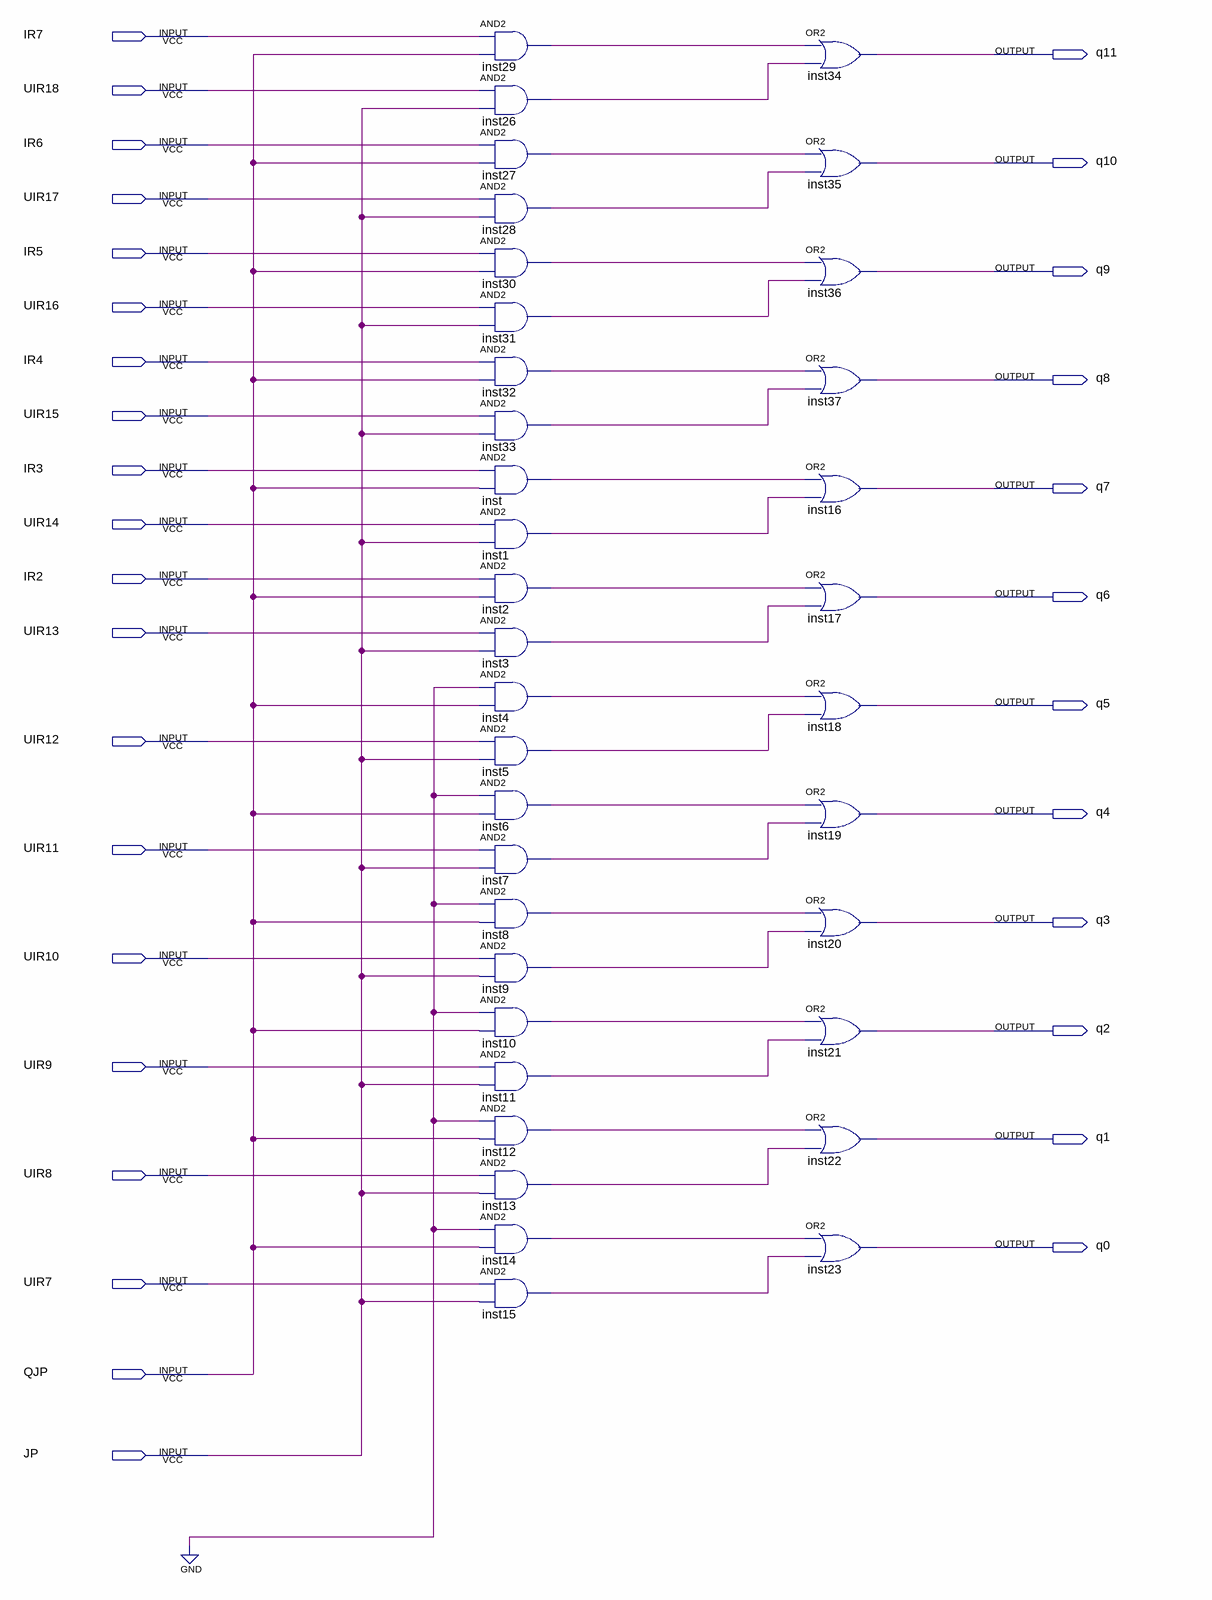
[diagram p0: schematic sheet]
// Quartus schematic hjcg.bdf as structural Verilog: 36 symbols, 32 pins
module hjcg (
  input  IR7,
  input  UIR18,
  input  IR6,
  input  UIR17,
  input  IR5,
  input  UIR16,
  input  IR4,
  input  UIR15,
  input  IR3,
  input  UIR14,
  input  IR2,
  input  UIR13,
  input  UIR12,
  input  UIR11,
  input  UIR10,
  input  UIR9,
  input  UIR8,
  input  UIR7,
  input  QJP,
  input  JP,
  output q11,
  output q10,
  output q9,
  output q8,
  output q7,
  output q6,
  output q5,
  output q4,
  output q3,
  output q2,
  output q1,
  output q0
);

  wire inst1_out, inst2_out, inst3_out, inst4_out, inst5_out, inst6_out, inst7_out, inst8_out, inst9_out,
       inst10_out, inst11_out, inst12_out, inst13_out, inst14_out, inst15_out, inst26_out, inst27_out,
       inst28_out, inst29_out, inst30_out, inst31_out, inst32_out, inst33_out, inst_out;

  and inst29 (inst29_out, IR7, QJP);
  and inst26 (inst26_out, UIR18, JP);
  and inst27 (inst27_out, IR6, QJP);
  and inst28 (inst28_out, UIR17, JP);
  and inst30 (inst30_out, IR5, QJP);
  and inst31 (inst31_out, UIR16, JP);
  and inst32 (inst32_out, IR4, QJP);
  and inst33 (inst33_out, UIR15, JP);
  and inst (inst_out, IR3, QJP);
  and inst1 (inst1_out, UIR14, JP);
  and inst2 (inst2_out, IR2, QJP);
  and inst3 (inst3_out, UIR13, JP);
  and inst4 (inst4_out, 1'b0, QJP);
  and inst5 (inst5_out, UIR12, JP);
  and inst6 (inst6_out, 1'b0, QJP);
  and inst7 (inst7_out, UIR11, JP);
  and inst8 (inst8_out, 1'b0, QJP);
  and inst9 (inst9_out, UIR10, JP);
  and inst10 (inst10_out, 1'b0, QJP);
  and inst11 (inst11_out, UIR9, JP);
  and inst12 (inst12_out, 1'b0, QJP);
  and inst13 (inst13_out, UIR8, JP);
  and inst14 (inst14_out, 1'b0, QJP);
  and inst15 (inst15_out, UIR7, JP);
  or inst34 (q11, inst29_out, inst26_out);
  or inst35 (q10, inst27_out, inst28_out);
  or inst36 (q9, inst30_out, inst31_out);
  or inst37 (q8, inst32_out, inst33_out);
  or inst16 (q7, inst_out, inst1_out);
  or inst17 (q6, inst2_out, inst3_out);
  or inst18 (q5, inst4_out, inst5_out);
  or inst19 (q4, inst6_out, inst7_out);
  or inst20 (q3, inst8_out, inst9_out);
  or inst21 (q2, inst10_out, inst11_out);
  or inst22 (q1, inst12_out, inst13_out);
  or inst23 (q0, inst14_out, inst15_out);
endmodule
